# Altium project Sampler.PrjPCB (part 4 of 5)

## Sheet Input_channel.SchDoc: =DocumentName
size A4; DocumentNumber: 1; Revision: 0; SheetNumber: 12; SheetTotal: 15; Version: 2.3.1; Author 1: Grzegorz Kasprowicz; Author 2: Łukasz Pająk; Author 3: Krzysztof Belewicz; Github: https://github.com/sinara-hw/Sampler; Last modified by: Krzysztof Belewicz
Used 8 times, as channels U_Input_channel0, U_Input_channel1, U_Input_channel2, U_Input_channel3, U_Input_channel4, U_Input_channel5, U_Input_channel6, U_Input_channel7. Parts and nets are listed once, with the designators drawn on the sheet.
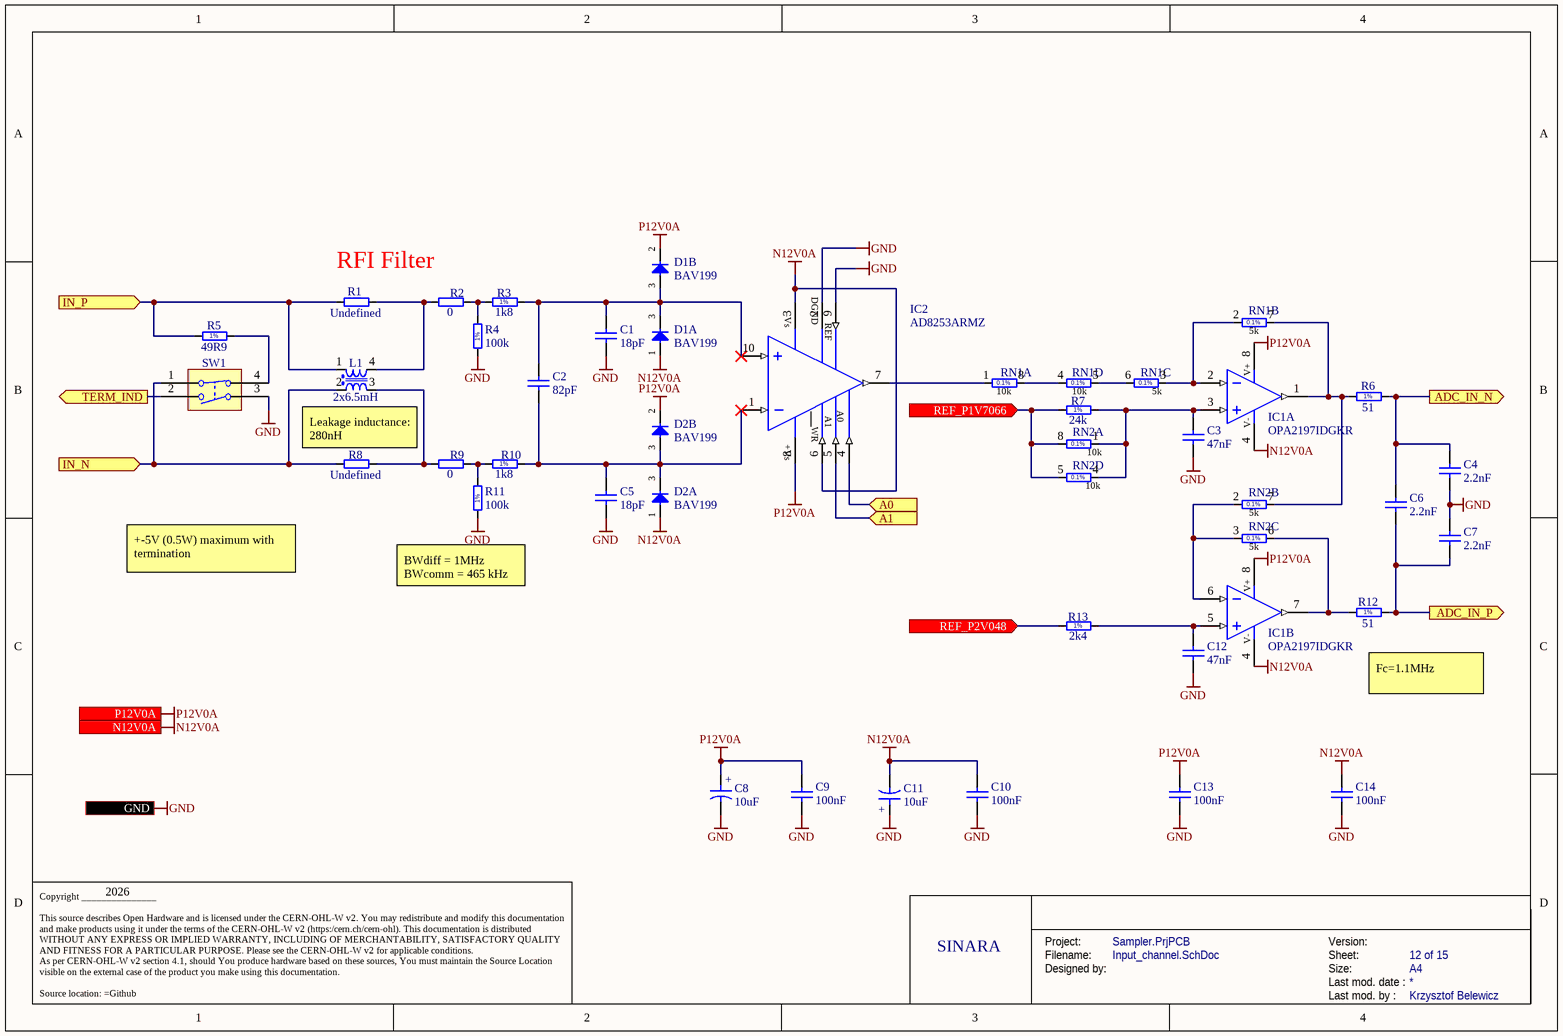
[diagram p11: Input_channel.SchDoc]

### Parts
C1  18pF  [CAPC1608X87N]
C2  82pF  [CAPC2012X90N]
C3  47nF  [CAPC2012X135N]
C4  2.2nF  [CAPC2013X100N]
C5  18pF  [CAPC1608X87N]
C6  2.2nF  [CAPC2013X100N]
C7  2.2nF  [CAPC2013X100N]
C8  10uF  [CAPMP3216X180N]
C9  100nF  [CAPC1005X55N]
C10  100nF  [CAPC1005X55N]
C11  10uF  [CAPMP3216X180N]
C12  47nF  [CAPC2012X135N]
C13  100nF  [CAPC1005X55N]
C14  100nF  [CAPC1005X55N]
D1  BAV199  [SOT95P240X110-3N]  (parts A,B of 2)
D2  BAV199  [SOT95P240X110-3N]  (parts A,B of 2)
IC1  OPA2197IDGKR  [SOP65P490X110-8N]  (parts A,B of 2)
IC2  AD8253ARMZ  [SOP50P490X110-10N]
L1  2x6.5mH  [IND_WURTH_WE-SL2]
R1  Undefined  [RESC1608X55N]
R2  0  [RESC1608X55N]
R3  1k8  [RESC1608X55N]
R4  100k  [RESC1608X55N]
R5  49R9  [RESC6331X70N]
R6  51  [RESC1005X40N]
R7  24k  [RESC1608X55N]
R8  Undefined  [RESC1608X55N]
R9  0  [RESC1608X55N]
R10  1k8  [RESC1608X55N]
R11  100k  [RESC1608X55N]
R12  51  [RESC1005X40N]
R13  2k4  [RESC1005X40N]
RN1  10k 5K 5K 10K  [SOIC127P600X175-8N]  (value not drawn)  (parts A,B,C,D of 4)
RN2  10k 5K 5K 10K  [SOIC127P600X175-8N]  (value not drawn)  (parts A,B,C,D of 4)
SW1  Switch  [SW_CTS_204-121ST]  (value not drawn)

### Ports
A0 (in), A1 (in), ADC_IN_N (out), ADC_IN_P (out), GND, IN_N (in), IN_P (in), N12V0A (in), P12V0A (in), REF_P1V7066 (in), REF_P2V048 (in), TERM_IND (out)

### Nets
GND: C1.1 C3.1 C4.1 C5.1 C7.2 C8.2 C9.1 C10.1 C11.1 C12.1 C13.1 C14.1 IC2.2(DGND) IC2.9(REF) R4.1 R11.1 SW1.3 ; port GND
N12V0A: C10.2 C11.2 C14.2 D1.1(A) D2.1(A) IC1.4(V-) IC2.3(-VS) IC2.6(~{WR}) ; port N12V0A
P12V0A: C8.1 C9.2 C13.2 D1.2(C) D2.2(C) IC1.8(V+) IC2.8(+VS) ; port P12V0A
A0: IC2.4(A0) ; port A0
A1: IC2.5(A1) ; port A1
ADC_IN_N: C4.2 C6.2 R6.2 ; port ADC_IN_N
ADC_IN_P: C6.1 C7.1 R12.2 ; port ADC_IN_P
IN_N: L1.2 R8.1 SW1.1 ; port IN_N
IN_P: L1.1 R1.1 R5.2 ; port IN_P
REF_P1V7066: R7.1 RN2.5 RN2.8 ; port REF_P1V7066
REF_P2V048: R13.1 ; port REF_P2V048
TERM_IND: SW1.2 ; port TERM_IND
NetC1_2: C1.2 C2.2 D1.3(COMAC) IC2.10(+IN) R3.2
NetC2_1: C2.1 C5.2 D2.3(COMAC) IC2.1(-IN) R10.2
NetC3_2: C3.2 IC1.3(IN+) R7.2 RN2.1 RN2.4
NetC12_2: C12.2 IC1.5(IN+) R13.2
NetIC1_1: IC1.1(OUT) R6.1 RN1.7 RN2.7
NetIC1_2: IC1.2(IN-) RN1.2 RN1.3
NetIC1_6: IC1.6(IN-) RN2.2 RN2.3
NetIC1_7: IC1.7(OUT) R12.1 RN2.6
NetIC2_7: IC2.7(OUT) RN1.1
NetL1_3: L1.3 R8.2 R9.1
NetL1_4: L1.4 R1.2 R2.1
NetR2_2: R2.2 R3.1 R4.2
NetR5_1: R5.1 SW1.4
NetR9_2: R9.2 R10.1 R11.2
NetRN1_4: RN1.4 RN1.8
NetRN1_5: RN1.5 RN1.6

### Channels
U_Input_channel0: designators end in H; ports A0=A00 A1=A10 ADC_IN_N=ADC_IN_N0 ADC_IN_P=ADC_IN_P0 GND=GND IN_N=IN_N0 IN_P=IN_P0 N12V0A=N12V0A P12V0A=P12V0A REF_P1V7066=REF_P1V7066 REF_P2V048=REF_P2V048 TERM_IND=TERM_IND0
U_Input_channel1: designators end in A; ports A0=A01 A1=A11 ADC_IN_N=ADC_IN_N1 ADC_IN_P=ADC_IN_P1 GND=GND IN_N=IN_N1 IN_P=IN_P1 N12V0A=N12V0A P12V0A=P12V0A REF_P1V7066=REF_P1V7066 REF_P2V048=REF_P2V048 TERM_IND=TERM_IND1
U_Input_channel2: designators end in B; ports A0=A02 A1=A12 ADC_IN_N=ADC_IN_N2 ADC_IN_P=ADC_IN_P2 GND=GND IN_N=IN_N2 IN_P=IN_P2 N12V0A=N12V0A P12V0A=P12V0A REF_P1V7066=REF_P1V7066 REF_P2V048=REF_P2V048 TERM_IND=TERM_IND2
U_Input_channel3: designators end in C; ports A0=A03 A1=A13 ADC_IN_N=ADC_IN_N3 ADC_IN_P=ADC_IN_P3 GND=GND IN_N=IN_N3 IN_P=IN_P3 N12V0A=N12V0A P12V0A=P12V0A REF_P1V7066=REF_P1V7066 REF_P2V048=REF_P2V048 TERM_IND=TERM_IND3
U_Input_channel4: designators end in D; ports A0=A04 A1=A14 ADC_IN_N=ADC_IN_N4 ADC_IN_P=ADC_IN_P4 GND=GND IN_N=IN_N4 IN_P=IN_P4 N12V0A=N12V0A P12V0A=P12V0A REF_P1V7066=REF_P1V7066 REF_P2V048=REF_P2V048 TERM_IND=TERM_IND4
U_Input_channel5: designators end in E; ports A0=A05 A1=A15 ADC_IN_N=ADC_IN_N5 ADC_IN_P=ADC_IN_P5 GND=GND IN_N=IN_N5 IN_P=IN_P5 N12V0A=N12V0A P12V0A=P12V0A REF_P1V7066=REF_P1V7066 REF_P2V048=REF_P2V048 TERM_IND=TERM_IND5
U_Input_channel6: designators end in F; ports A0=A06 A1=A16 ADC_IN_N=ADC_IN_N6 ADC_IN_P=ADC_IN_P6 GND=GND IN_N=IN_N6 IN_P=IN_P6 N12V0A=N12V0A P12V0A=P12V0A REF_P1V7066=REF_P1V7066 REF_P2V048=REF_P2V048 TERM_IND=TERM_IND6
U_Input_channel7: designators end in G; ports A0=A07 A1=A17 ADC_IN_N=ADC_IN_N7 ADC_IN_P=ADC_IN_P7 GND=GND IN_N=IN_N7 IN_P=IN_P7 N12V0A=N12V0A P12V0A=P12V0A REF_P1V7066=REF_P1V7066 REF_P2V048=REF_P2V048 TERM_IND=TERM_IND7

### Notes on the sheet
- RFI Filter
- Leakage inductance: 280nH
- +-5V (0.5W) maximum with termination
- (near R11) BWdiff = 1MHz
  BWcomm = 465 kHz
- (near R12) Fc=1.1MHz
- 2026
- SINARA
- Project:
- Designed by:
- Filename:
- Size:
- Version:
- Last mod. date :
- Sheet:
- A4
- Copyright _______________
  This source describes Open Hardware and is licensed under the CERN-OHL-W v2. You may redistribute and modify this documentation and make products using it under the terms of the CERN-OHL-W v2 (https:/cern.ch/cern-ohl). This documentation is distributed WITHOUT ANY EXPRESS OR IMPLIED WARRANTY, INCLUDING OF MERCHANTABILITY, SATISFACTORY QUALITY AND FITNESS FOR A PARTICULAR PURPOSE. Please see the CERN-OHL-W v2 for applicable conditions.
  As per CERN-OHL-W v2 section 4.1, should You produce hardware based on these sources, You must maintain the Source Location visible on the external case of the product you make using this documentation.
  Source location: =Github
- Last mod. by :
- (in symbol AD8253ARMZ) -Vs; WR; +Vs
- (in symbol CTE3216-18_10UF_16V_20%_AVX_TCJ) +
- (in symbol R0402_2K4_1%_0.0625W_100PPM) 1%
- (in symbol R0402_51R_1%_0.0625W_100PPM) 1%
- (in symbol R0603_1K8_1%_0.1W_100PPM) 1%
- (in symbol R0603_24K_1%_0.1W_100PPM) 1%
- (in symbol R0603_100K_1%_0.1W_100PPM) 1%
- (in symbol R2512_49R9_1%_1W_100PPM_VISHAY_CRCW) 1%
- (in symbol RN_10K_5K_VISHAY_AORN2-1AT3, part A) 10k
- (in symbol RN_10K_5K_VISHAY_AORN2-1AT3, part B) 5k
- (in symbol RN_10K_5K_VISHAY_AORN2-1AT3, part C) 5k
- (in symbol RN_10K_5K_VISHAY_AORN2-1AT3, part D) 10k

### Library data of the parts
C1 C5 = CC0603_18PF_50V_5%_NP0: Non-polarised capacitor; Part Description: SMD Multilayer Chip Ceramic Capacitor; Manufacturer: GENERIC; Manufacturer1 Part Number: 223886715189; Voltage: 50V; TC: C0G/NP0; Tolerance: ±5%; Part Number: CC0603_18PF_50V_5%_NP0; Component Kind: Standard; Component Type: Standard; Pin Count: 2; Value: 18pF; Status: Preferred; Manufacturer Part Number: CC0603_18PF_50V_5%_NP0; Case: 0603; Mounted: Yes; Socket: No; SMD: Yes; Sense: No; Manufacturer1 Example: PHYCOMP; Manufacturer1 ComponentHeight: 0.87mm; HelpURL: \\cern.ch\dfs\Applications\Altium\Datasheets\CC0603_NP0_PHYCOMP.pdf; Author: CERN DEM JLC; CreateDate: 03.12.2007; LatestRevisionDate: 03.12.2007
C2 = CC0805_82PF_100V_1%_NP0_AVX_08051A820FAT2A: Non-polarised capacitor; Part Description: SMD Multilayer Chip Ceramic Capacitor; Manufacturer: AVX; Voltage: 100V; TC: NP0; Tolerance: ±1%; Part Number: CC0805_82PF_100V_1%_NP0_AVX_08051A820FAT2A; Component Kind: Standard; Component Type: Standard; Pin Count: 2; Value: 82pF; Status: Not Recommended; Manufacturer Part Number: 08051A820FAT2A; Case: 0805; Mounted: Yes; Socket: No; SMD: Yes; Sense: No; ComponentHeight: 0.9mm; HelpURL: \\cern.ch\dfs\Applications\Altium\Datasheets\CC0805_C0G_AVX.pdf; Author: CERN DEM WB; CreateDate: 26.07.2016; LatestRevisionDate: 26.07.2016
C3 C12 = CC0805_47NF_25V_5%_C0G: Non-polarised capacitor; Part Description: SMD Multilayer Chip Ceramic Capacitor; Manufacturer: GENERIC; Manufacturer1 Part Number: C0805C473J3GACTU; Voltage: 25V; TC: C0G/NP0; Tolerance: ±5%; Part Number: CC0805_47NF_25V_5%_C0G; Component Kind: Standard; Component Type: Standard; Pin Count: 2; Value: 47nF; Status: None; Manufacturer Part Number: CC0805_47NF_25V_5%_C0G; Case: 0805; Mounted: Yes; Socket: No; SMD: Yes; Sense: No; Manufacturer1 Example: KEMET; Manufacturer1 ComponentHeight: 1.4mm; HelpURL: \\cern.ch\dfs\Applications\Altium\Datasheets\CC0805_C0G_KEMET_(Commercial Grade).pdf; Author: CERN DEM JLC; CreateDate: 18.01.2011; LatestRevisionDate: 18.01.2011
C4 C6 C7 = CC0805_2.2NF_25V_1%_C0G: Non-polarised capacitor; Part Description: SMD Multilayer Chip Ceramic Capacitor; Manufacturer: GENERIC; Manufacturer1 Part Number: C0805C222F3GACTU; Voltage: 25V; TC: C0G/NP0; Tolerance: ±1%; Part Number: CC0805_2.2NF_25V_1%_C0G; Component Kind: Standard; Component Type: Standard; Pin Count: 2; Value: 2.2nF; Status: None; Manufacturer Part Number: CC0805_2.2NF_25V_1%_C0G; Case: 0805; Mounted: Yes; Socket: No; SMD: Yes; Sense: No; Manufacturer1 Example: KEMET; Manufacturer1 ComponentHeight: 0.88mm; HelpURL: \\cern.ch\dfs\Applications\Altium\Datasheets\CC0805_C0G_KEMET_(Commercial Grade).pdf; Author: CERN DEM JLC; CreateDate: 11.03.2015; LatestRevisionDate: 11.03.2015
C8 C11 = CTE3216-18_10UF_16V_20%_AVX_TCJ: Polarised capacitor; Part Description: ESR 0R200 Tantalum Solid Electrolytic Chip Capacitor with Conductive Polymer Electrode; Manufacturer: AVX; Manufacturer Part Number: TCJA106M016R0200; Voltage: 16V; Tolerance: ±20%; Part Number: CTE3216-18_10UF_16V_20%_AVX_TCJ; Component Kind: Standard; Component Type: Standard; Pin Count: 2; Value: 10uF; Status: Preferred; Case: A; Mounted: Yes; Socket: No; SMD: Yes; Sense: No; ComponentHeight: 1.8mm; HelpURL: \\cern.ch\dfs\Applications\Altium\Datasheets\CTE_AVX_TCJ.pdf; Author: CERN DEM JLC; CreateDate: 29.03.2012; LatestRevisionDate: 29.03.2012
C9 C10 C13 C14 = CC0402_100NF_50V_10%_X7R: as T_C3-T_C6 on sheet EEM_Connectors; Part Number: CC0402_100NF_50V_10%_X7R; Component Kind: Standard; Component Type: Standard; Pin Count: 2; Value: 100nF; Status: None; Manufacturer Part Number: CC0402_100NF_50V_10%_X7R; Case: 0402; Mounted: Yes; Socket: No; SMD: Yes; Sense: No; Manufacturer1 Example: MURATA; Manufacturer1 ComponentHeight: 0.55mm; HelpURL: \\cern.ch\dfs\Applications\Altium\Datasheets\CC0402_MURATA_GRM155R71H104KE14D.pdf; Author: CERN DEM MR; CreateDate: 30.06.2017; LatestRevisionDate: 30.06.2017
D1 D2 = BAV199: Serial Diode; Part Description: Low-Leakage Double Diode; Manufacturer: NXP SEMICONDUCTORS; Voltage: 75V; Power: 250mW; PressFit: No; Bonding: No; Part Number: BAV199; Component Kind: Standard; Component Type: Standard; Device: BAV199; PackageDescription: SOT23 3-Leads, Pitch 0.95mm - Body 1.4x3mm, IPC Medium Density; Manufacturer Part Number: BAV199; Pin Count: 3; Case: SOT23-3; Mounted: Yes; Socket: No; SMD: Yes; Sense: No; ComponentHeight: 1.1mm; HelpURL: \\cern.ch\dfs\Applications\Altium\Datasheets\BAV199.pdf; Author: CERN DEM JMW; CreateDate: 2008-11-21; LatestRevisionDate: 2008-11-21
IC1 = OA_OPA2197IDGKR: 36-V, Precision, Rail-to-Rail Input Output, Low Offset Voltage Op Amp 8-VSSOP; Part Description: High-Precision, Low-Noise, Rail-to-Rail Output,10-MHz Op Amp; Manufacturer: TEXAS INSTRUMENTS; PressFit: No; Bonding: No; Part Number: OPA2197IDGKR; Component Kind: Standard; Component Type: Standard; Device: OPA2197IDGKR; PackageDescription: SOP, 0.65mm pitch; 8 pin, 3.00mm W X 3.00mm L X 1.10mm H body, IPC Medium Density; Manufacturer Part Number: OPA2197IDGKR; Pin Count: 8; Case: MSOP8; Mounted: Yes; Socket: No; SMD: Yes; Sense: No; ComponentHeight: 1.1mm; Author: GK; HelpURL: \\cern.ch\dfs\Applications\Altium\Datasheets\OPA2140AIDGK.pdf; CreateDate: 20.04.2017; LatestRevisionDate: 20.04.2017
IC2 = AD8253ARMZ: 10MHz, 20V/us, G= 1, 10, 100, 1000 iCMOS Programmable Gain Instrumentation Amplifier; Manufacturer: ANALOG DEVICES; PressFit: No; Bonding: No; Part Number: AD8253ARMZ; Component Kind: Standard; Component Type: Standard; Device: AD8253ARMZ; PackageDescription: MSOP, 10-Leads, Body 3.1x3.1mm (max), Pitch 0.50mm, IPC Medium Density; Part Description: 10MHz, 20V/us, G= 1, 10, 100, 1000 iCMOS Programmable Gain Instrumentation Amplifier; Manufacturer Part Number: AD8253ARMZ; Pin Count: 8; Case: MSOP10; Mounted: Yes; Socket: No; SMD: Yes; Sense: No; ComponentHeight: 1.1mm; Author: CERN DEM JLC; HelpURL: \\cern.ch\dfs\Applications\Altium\Datasheets\AD8253ARMZ.pdf; CreateDate: 2013-10-02; LatestRevisionDate: 2013-10-02
L1 = IND_6.5MH_50%_WURTH_WE-SL2-744229: Inductor Common Mode; Part Description: Common Mode SMD Line Filter (WE-SL2 Serie); Manufacturer: WURTH ELEKTRONIK; Manufacturer Part Number: 744229; Power: 400mA; Resistance: 0.95R; Tolerance: ±50%; Part Number: IND_6.5MH_50%_WURTH_WE-SL2-744229; Component Kind: Standard; Component Type: Standard; Pin Count: 4; Value: 2x6.5mH; Status: None; Mounted: Yes; Socket: No; SMD: Yes; Sense: No; ComponentHeight: 5.3mm; HelpURL: \\cern.ch\dfs\Applications\Altium\Datasheets\IND_WURTH_WE-SL2_744229.pdf; Author: CERN DEM JLC; CreateDate: 01.10.2012; LatestRevisionDate: 15.10.2012
R1 R8 = R0603_NO-VALUE: Resistor; Part Description: Reserved Footprint For a 0603 (1608) Chip Resistor; Mounted: No; Part Number: R0603_NO-VALUE; Component Kind: Standard; Component Type: Standard; Pin Count: 2; Value: Undefined; Status: None; Manufacturer: Undefined; Manufacturer Part Number: R0603_NO-VALUE; Case: 0603; Sense: No; Socket: No; SMD: Yes; Manufacturer1 Example: Undefined; Manufacturer1 Part Number: Undefined; Manufacturer1 ComponentHeight: Undefined; HelpURL: Undefined; Author: CERN DEM JLC; CreateDate: 03.12.2007; LatestRevisionDate: 13.03.2008
R2 R9 = R0603_0R_JUMPER: Resistor; Part Description: 1A (0.05R Max DC Resistance) Zero Ohm Jumper; Manufacturer: GENERIC; Manufacturer1 Part Number: NRC06Z0; Part Number: R0603_0R_JUMPER; Component Kind: Standard; Component Type: Standard; Pin Count: 2; Value: 0; Status: Preferred; Manufacturer Part Number: R0603_0R_JUMPER; Case: 0603; Mounted: Yes; Sense: No; Socket: No; SMD: Yes; Manufacturer1 Example: NIC COMPONENT; Manufacturer1 ComponentHeight: 0.55mm; HelpURL: \\cern.ch\dfs\Applications\Altium\Datasheets\R0603_NIC_NRC.pdf; Author: CERN DEM JLC; CreateDate: 03.12.2007; LatestRevisionDate: 13.03.2008
R3 R10 = R0603_1K8_1%_0.1W_100PPM: Resistor - 1%; Part Description: General Purpose Thick Film Chip Resistor; Manufacturer: GENERIC; Manufacturer1 Part Number: NRC06F1801TRF; Power: 0.1W; TC: ±100ppm/°C; Part Number: R0603_1K8_1%_0.1W_100PPM; Component Kind: Standard; Component Type: Standard; Pin Count: 2; Value: 1k8; Status: Preferred; Tolerance: ±1%; Manufacturer Part Number: R0603_1K8_1%_0.1W_100PPM; Case: 0603; Mounted: Yes; Sense: No; Socket: No; SMD: Yes; Manufacturer1 Example: NIC COMPONENT; Manufacturer1 ComponentHeight: 0.55mm; HelpURL: \\cern.ch\dfs\Applications\Altium\Datasheets\R0603_NIC_NRC.pdf; Author: CERN DEM JLC; CreateDate: 03.12.2007; LatestRevisionDate: 13.03.2008
R4 R11 = R0603_100K_1%_0.1W_100PPM: Resistor - 1%; Part Description: General Purpose Thick Film Chip Resistor; Manufacturer: GENERIC; Manufacturer1 Part Number: NRC06F1003TRF; Power: 0.1W; TC: ±100ppm/°C; Part Number: R0603_100K_1%_0.1W_100PPM; Component Kind: Standard; Component Type: Standard; Pin Count: 2; Value: 100k; Status: Preferred; Tolerance: ±1%; Manufacturer Part Number: R0603_100K_1%_0.1W_100PPM; Case: 0603; Mounted: Yes; Sense: No; Socket: No; SMD: Yes; Manufacturer1 Example: NIC COMPONENT; Manufacturer1 ComponentHeight: 0.55mm; HelpURL: \\cern.ch\dfs\Applications\Altium\Datasheets\R0603_NIC_NRC.pdf; Author: CERN DEM JLC; CreateDate: 03.12.2007; LatestRevisionDate: 13.03.2008
R5 = R2512_49R9_1%_1W_100PPM_VISHAY_CRCW: Resistor - 1%; Part Description: Thick Film Chip Resistor; Manufacturer: VISHAY DRALORIC; Manufacturer Part Number: CRCW251249R9FKEG; Power: 1W; TC: ±100ppm/°C; PressFit: No; Part Number: R2512_49R9_1%_1W_100PPM_VISHAY_CRCW; Component Kind: Standard; Component Type: Standard; Pin Count: 2; Value: 49R9; Status: None; Tolerance: ±1%; Case: 2512; Mounted: Yes; Sense: No; Socket: No; SMD: Yes; ComponentHeight: 0.7mm; HelpURL: \\cern.ch\dfs\Applications\Altium\Datasheets\R2512_VISHAY_CRCW2512.pdf; Author: CERN DEM JLC; CreateDate: 22.05.2012; LatestRevisionDate: 22.05.2012
R6 R12 = R0402_51R_1%_0.0625W_100PPM: Resistor - 1%; Part Description: General Purpose Thick Film Chip Resistor; Manufacturer: GENERIC; Manufacturer1 Part Number: 232270675109L; TC: ±100ppm/°C; PressFit: No; Part Number: R0402_51R_1%_0.0625W_100PPM; Component Kind: Standard; Component Type: Standard; Pin Count: 2; Value: 51; Status: Not Recommended; Power: 0.0625W; Tolerance: ±1%; Manufacturer Part Number: R0402_51R_1%_0.0625W_100PPM; Case: 0402; Mounted: Yes; Sense: No; Socket: No; SMD: Yes; Manufacturer1 Example: YAGEO PHYCOMP; Manufacturer1 ComponentHeight: 0.4mm; HelpURL: \\cern.ch\dfs\Applications\Altium\Datasheets\R0402_Phycomp_RC0402.pdf; Author: CERN DEM JLC; CreateDate: 03.12.2007; LatestRevisionDate: 17.10.2012
R7 = R0603_24K_1%_0.1W_100PPM: Resistor - 1%; Part Description: General Purpose Thick Film Chip Resistor; Manufacturer: GENERIC; Manufacturer1 Part Number: NRC06F2402TRF; Power: 0.1W; TC: ±100ppm/°C; PressFit: No; Part Number: R0603_24K_1%_0.1W_100PPM; Component Kind: Standard; Component Type: Standard; Pin Count: 2; Value: 24k; Status: Preferred; Tolerance: ±1%; Manufacturer Part Number: R0603_24K_1%_0.1W_100PPM; Case: 0603; Mounted: Yes; Sense: No; Socket: No; SMD: Yes; Manufacturer1 Example: NIC COMPONENT; Manufacturer1 ComponentHeight: 0.55mm; HelpURL: \\cern.ch\dfs\Applications\Altium\Datasheets\R0603_NIC_NRC.pdf; Author: CERN DEM JLC; CreateDate: 03.12.2007; LatestRevisionDate: 13.03.2008
R13 = R0402_2K4_1%_0.0625W_100PPM: Resistor - 1%; Part Description: General Purpose Thick Film Chip Resistor; Manufacturer: GENERIC; Manufacturer1 Part Number: 232270672402L; TC: ±100ppm/°C; PressFit: No; Part Number: R0402_2K4_1%_0.0625W_100PPM; Component Kind: Standard; Component Type: Standard; Pin Count: 2; Value: 2k4; Status: Not Recommended; Power: 0.0625W; Tolerance: ±1%; Manufacturer Part Number: R0402_2K4_1%_0.0625W_100PPM; Case: 0402; Mounted: Yes; Sense: No; Socket: No; SMD: Yes; Manufacturer1 Example: YAGEO PHYCOMP; Manufacturer1 ComponentHeight: 0.4mm; HelpURL: \\cern.ch\dfs\Applications\Altium\Datasheets\R0402_Phycomp_RC0402.pdf; Author: CERN DEM JLC; CreateDate: 03.12.2007; LatestRevisionDate: 17.10.2012
RN1 RN2 = RN_10K_5K_VISHAY_AORN2-1AT3: DIL8 Resistor Network 4 Resistors 10k-5k-5k-10k 0.1%; Part Description: Dual-In-Line Thin Film Precision Automotive Resistors Network, (4 Isolated) - AORN Series; Manufacturer: VISHAY DALE; Power: 4x0.1W; TC: ±25ppm/°C; PressFit: No; Part Number: RN_10K_5K_VISHAY_AORN2-1AT3; Component Kind: Standard; Component Type: Standard; Pin Count: 8; Value: 10k 5K 5K 10K; Sense: No; Tolerance: 0.1%; Manufacturer Part Number: AORN2-1AT3; Case: SOIC8; Mounted: Yes; Socket: No; SMD: Yes; ComponentHeight: 1.73mm; HelpURL: \\cern.ch\dfs\Applications\Altium\Datasheets\RN_VISHAY_AORN.pdf; Author: CERN DEM JLC; CreateDate: 20.02.2017; LatestRevisionDate: 20.02.2017
SW1 = SW_CTS_204-121ST: 2x SPST DIP Switch 1NO + 1NF; Part Description: Coupled SPST DIP Switch, 1NO + 1NF, CTS 204 Series; Manufacturer: CTS; PressFit: No; Part Number: SW_CTS_204-121ST; Component Kind: Standard; Component Type: Standard; Pin Count: 4; PackageDescription: Body 7.26 x 9.78mm, 2x SPST DIP, 1NO + 1NF Switch, CTS 204 Series; Family: Switch; Mounted: Yes; Socket: No; SMD: Yes; Sense: No; Status: None; Manufacturer Part Number: 204-121ST; ComponentHeight: 10.36mm; HelpURL: \\cern.ch\dfs\Applications\Altium\Datasheets\SW_CTS_204-121ST.pdf; Author: CERN DEM JLC; CreateDate: 28.08.2014; LatestRevisionDate: 28.08.2014

## Sheet Drivers.SchDoc: =DocumentName
size A3; DocumentNumber: 1; Revision: 0; SheetNumber: 14; SheetTotal: 15; Version: 2.3.1; Author 1: Grzegorz Kasprowicz; Author 2: Łukasz Pająk; Author 3: Krzysztof Belewicz; Github: https://github.com/sinara-hw/Sampler; Last modified by: Krzysztof Belewicz
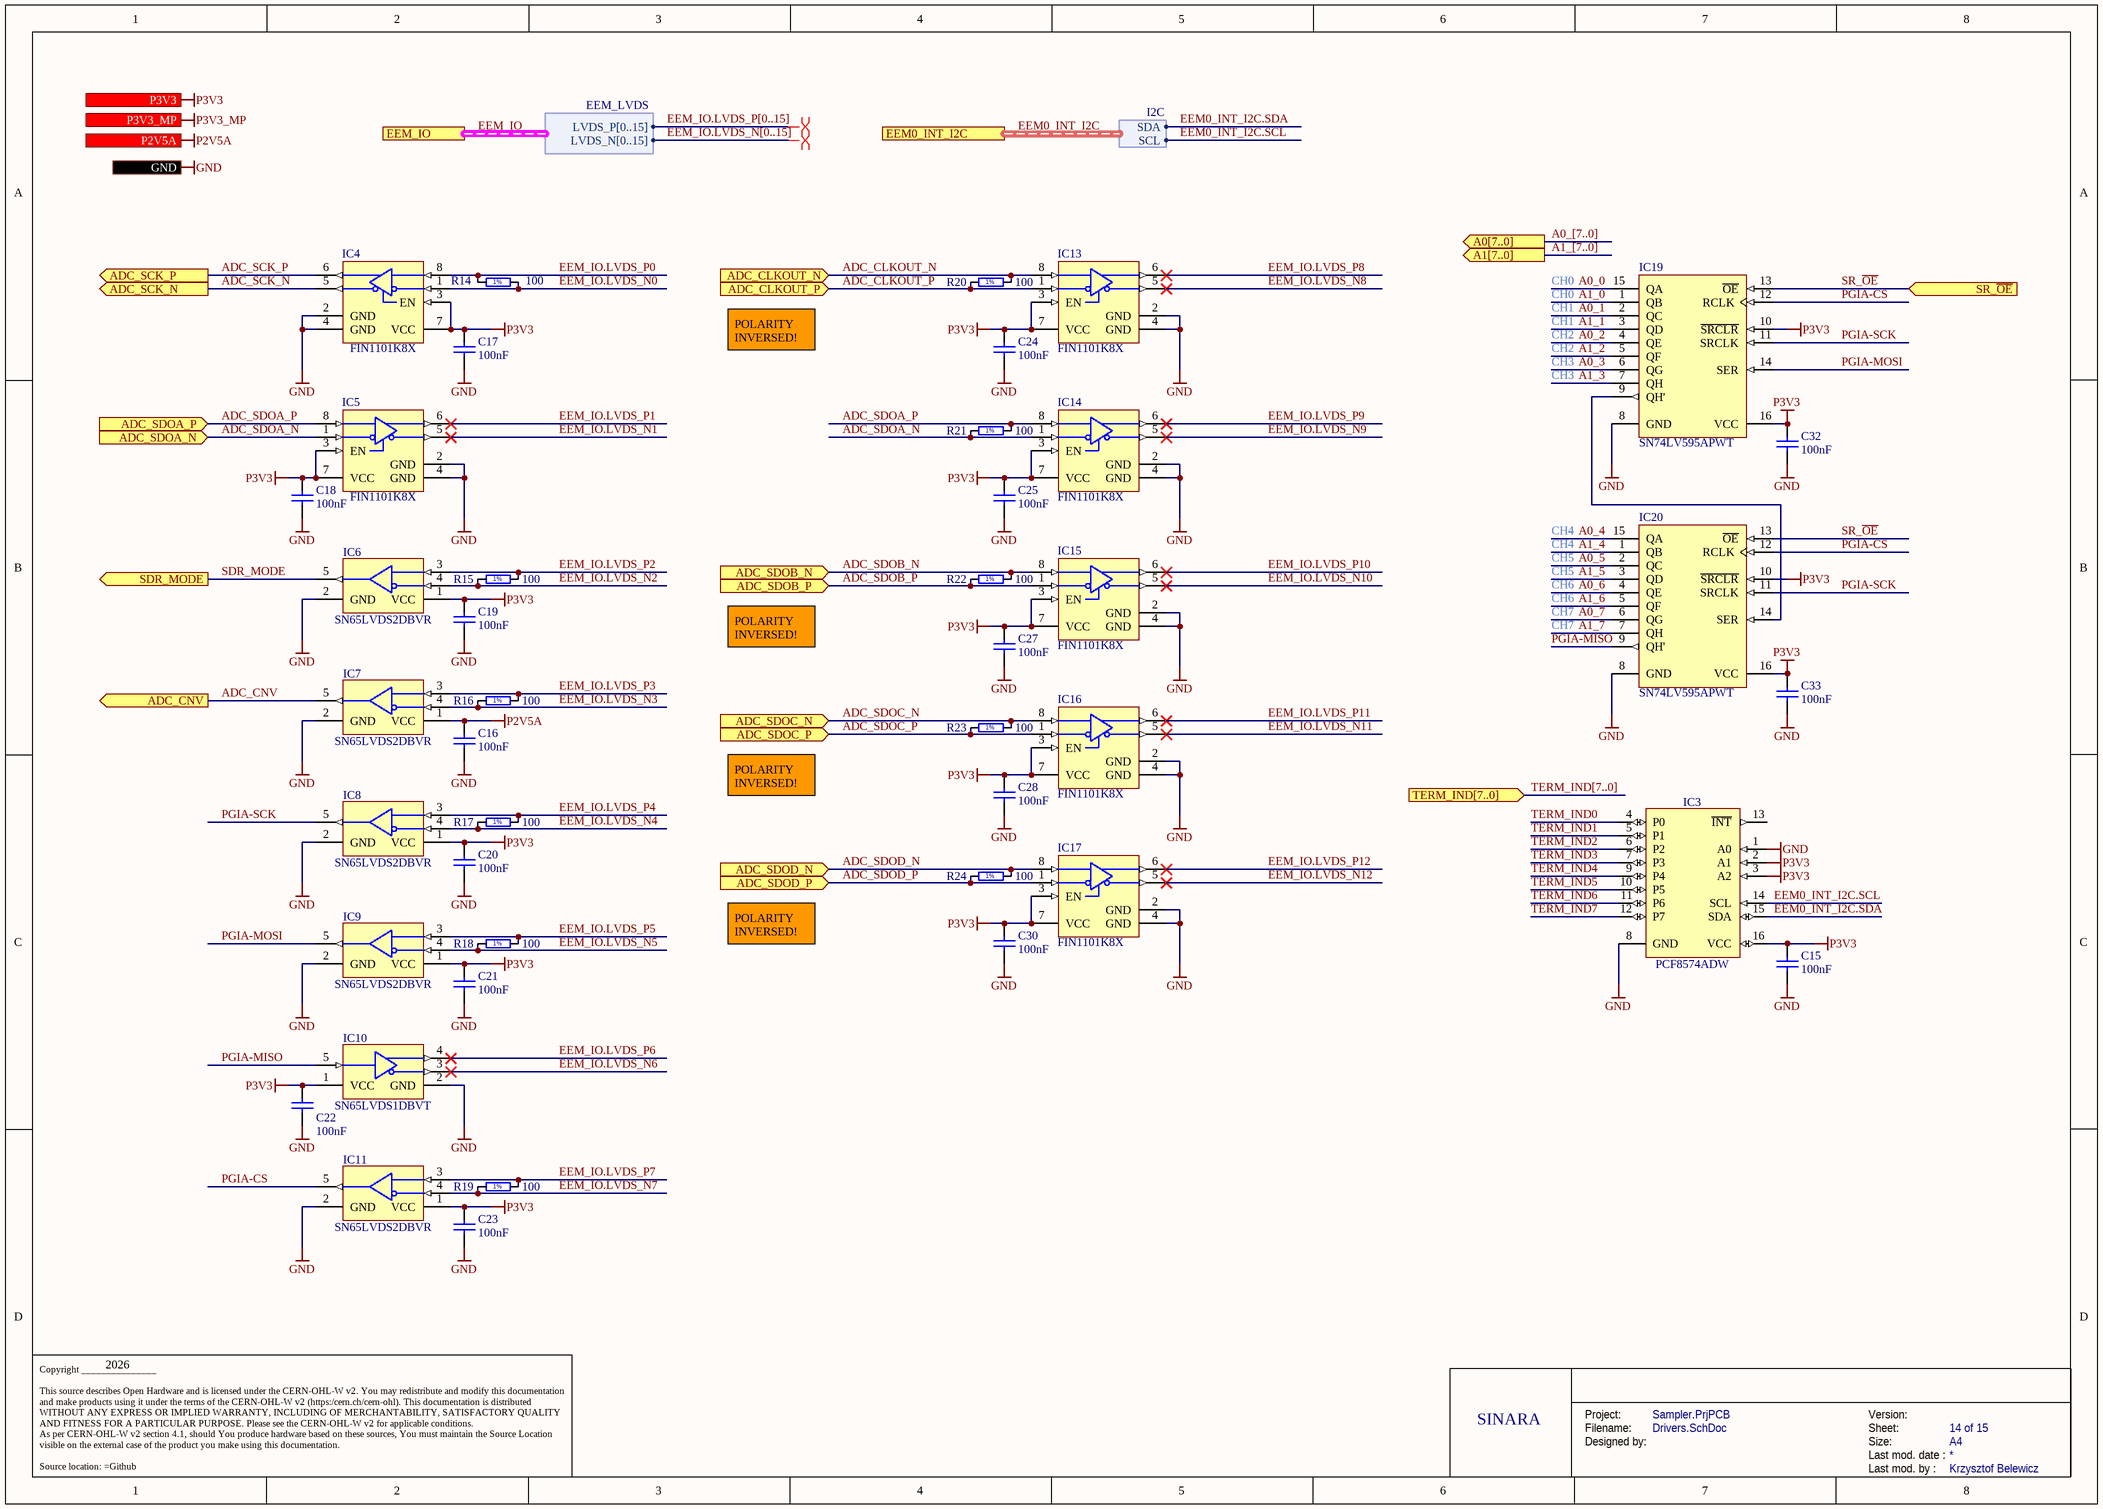
[diagram p12: Drivers.SchDoc]

### Parts
C15  100nF  [CAPC1005X55N]
C16  100nF  [CAPC1005X55N]
C17  100nF  [CAPC1005X55N]
C18  100nF  [CAPC1005X55N]
C19  100nF  [CAPC1005X55N]
C20  100nF  [CAPC1005X55N]
C21  100nF  [CAPC1005X55N]
C22  100nF  [CAPC1005X55N]
C23  100nF  [CAPC1005X55N]
C24  100nF  [CAPC1005X55N]
C25  100nF  [CAPC1005X55N]
C27  100nF  [CAPC1005X55N]
C28  100nF  [CAPC1005X55N]
C30  100nF  [CAPC1005X55N]
C32  100nF  [CAPC1005X55N]
C33  100nF  [CAPC1005X55N]
IC3  PCF8574ADW  [SOIC127P1030X265-16N]
IC4  FIN1101K8X  [SOP50P310X90-8N]
IC5  FIN1101K8X  [SOP50P310X90-8N]
IC6  SN65LVDS2DBVR  [SOT95P280X145-5N]
IC7  SN65LVDS2DBVR  [SOT95P280X145-5N]
IC8  SN65LVDS2DBVR  [SOT95P280X145-5N]
IC9  SN65LVDS2DBVR  [SOT95P280X145-5N]
IC10  SN65LVDS1DBVT  [SOT95P280X145-5N]
IC11  SN65LVDS2DBVR  [SOT95P280X145-5N]
IC13  FIN1101K8X  [SOP50P310X90-8N]
IC14  FIN1101K8X  [SOP50P310X90-8N]
IC15  FIN1101K8X  [SOP50P310X90-8N]
IC16  FIN1101K8X  [SOP50P310X90-8N]
IC17  FIN1101K8X  [SOP50P310X90-8N]
IC19  SN74LV595APWT  [SOP65P640X120-16N]
IC20  SN74LV595APWT  [SOP65P640X120-16N]
R14  100  [RESC1005X40N]
R15  100  [RESC1005X40N]
R16  100  [RESC1005X40N]
R17  100  [RESC1005X40N]
R18  100  [RESC1005X40N]
R19  100  [RESC1005X40N]
R20  100  [RESC1005X40N]
R21  100  [RESC1005X40N]
R22  100  [RESC1005X40N]
R23  100  [RESC1005X40N]
R24  100  [RESC1005X40N]

### Ports
A0[7..0] (out), A1[7..0] (out), ADC_CLKOUT_N (in), ADC_CLKOUT_P (in), ADC_CNV (out), ADC_SCK_N (out), ADC_SCK_P (out), ADC_SDOA_N (in), ADC_SDOA_P (in), ADC_SDOB_N (in), ADC_SDOB_P (in), ADC_SDOC_N (in), ADC_SDOC_P (in), ADC_SDOD_N (in), ADC_SDOD_P (in), EEM0_INT_I2C (harness I2C), EEM_IO (harness EEM_LVDS), GND, P2V5A (in), P3V3 (in), P3V3_MP (in), SDR_MODE (out), SR_~{OE} (in), TERM_IND[7..0] (in)

### Harnesses
EEM_LVDS: LVDS_P[0..15], LVDS_N[0..15]
I2C: SDA, SCL

### Nets
GND: C15.1 C16.1 C17.1 C18.1 C19.1 C20.1 C21.1 C22.1 C23.1 C24.1 C25.1 C27.1 C28.1 C30.1 C32.1 C33.1 IC3.1(A0) IC3.8(GND) IC4.2(GND) IC4.4(GND) IC5.2(GND) IC5.4(GND) IC6.2(GND) IC7.2(GND) IC8.2(GND) IC9.2(GND) IC10.2(GND) IC11.2(GND) IC13.2(GND) IC13.4(GND) IC14.2(GND) IC14.4(GND) IC15.2(GND) IC15.4(GND) IC16.2(GND) IC16.4(GND) IC17.2(GND) IC17.4(GND) IC19.8(GND) IC20.8(GND) ; port GND
P2V5A: C16.2 IC7.1(VCC) ; port P2V5A
P3V3: C15.2 C17.2 C18.2 C19.2 C20.2 C21.2 C22.2 C23.2 C24.2 C25.2 C27.2 C28.2 C30.2 C32.2 C33.2 IC3.2(A1) IC3.3(A2) IC3.16(VCC) IC4.3(EN) IC4.7(VCC) IC5.3(EN) IC5.7(VCC) IC6.1(VCC) IC8.1(VCC) IC9.1(VCC) IC10.1(VCC) IC11.1(VCC) IC13.3(EN) IC13.7(VCC) IC14.3(EN) IC14.7(VCC) IC15.3(EN) IC15.7(VCC) IC16.3(EN) IC16.7(VCC) IC17.3(EN) IC17.7(VCC) IC19.10(~{SRCLR}) IC19.16(VCC) IC20.10(~{SRCLR}) IC20.16(VCC) ; port P3V3
A0_0: IC19.15(QA)  [project net A00]
A0_1: IC19.2(QC)  [project net A01]
A0_2: IC19.4(QE)  [project net A02]
A0_3: IC19.6(QG)  [project net A03]
A0_4: IC20.15(QA)  [project net A04]
A0_5: IC20.2(QC)  [project net A05]
A0_6: IC20.4(QE)  [project net A06]
A0_7: IC20.6(QG)  [project net A07]
A1_0: IC19.1(QB)  [project net A10]
A1_1: IC19.3(QD)  [project net A11]
A1_2: IC19.5(QF)  [project net A12]
A1_3: IC19.7(QH)  [project net A13]
A1_4: IC20.1(QB)  [project net A14]
A1_5: IC20.3(QD)  [project net A15]
A1_6: IC20.5(QF)  [project net A16]
A1_7: IC20.7(QH)  [project net A17]
ADC_CLKOUT_N: IC13.8(RIN+) R20.2 ; port ADC_CLKOUT_N
ADC_CLKOUT_P: IC13.1(RIN-) R20.1 ; port ADC_CLKOUT_P
ADC_CNV: IC7.5(R) ; port ADC_CNV
ADC_SCK_N: IC4.5(DOUT-) ; port ADC_SCK_N
ADC_SCK_P: IC4.6(DOUT+) ; port ADC_SCK_P
ADC_SDOA_N: IC5.1(RIN-) IC14.1(RIN-) R21.1 ; port ADC_SDOA_N
ADC_SDOA_P: IC5.8(RIN+) IC14.8(RIN+) R21.2 ; port ADC_SDOA_P
ADC_SDOB_N: IC15.8(RIN+) R22.2 ; port ADC_SDOB_N
ADC_SDOB_P: IC15.1(RIN-) R22.1 ; port ADC_SDOB_P
ADC_SDOC_N: IC16.8(RIN+) R23.2 ; port ADC_SDOC_N
ADC_SDOC_P: IC16.1(RIN-) R23.1 ; port ADC_SDOC_P
ADC_SDOD_N: IC17.8(RIN+) R24.2 ; port ADC_SDOD_N
ADC_SDOD_P: IC17.1(RIN-) R24.1 ; port ADC_SDOD_P
EEM0_INT_I2C.SCL: IC3.14(SCL) ; port EEM0_INT_I2C.SCL
EEM0_INT_I2C.SDA: IC3.15(SDA) ; port EEM0_INT_I2C.SDA
EEM_IO.LVDS_N0: IC4.1(RIN-) R14.1
EEM_IO.LVDS_N1: IC5.5(DOUT-)
EEM_IO.LVDS_N2: IC6.4(B) R15.1
EEM_IO.LVDS_N3: IC7.4(B) R16.1
EEM_IO.LVDS_N4: IC8.4(B) R17.1
EEM_IO.LVDS_N5: IC9.4(B) R18.1
EEM_IO.LVDS_N6: IC10.3(A)
EEM_IO.LVDS_N7: IC11.4(B) R19.1
EEM_IO.LVDS_N8: IC13.5(DOUT-)
EEM_IO.LVDS_N9: IC14.5(DOUT-)
EEM_IO.LVDS_N10: IC15.5(DOUT-)
EEM_IO.LVDS_N11: IC16.5(DOUT-)
EEM_IO.LVDS_N12: IC17.5(DOUT-)
EEM_IO.LVDS_P0: IC4.8(RIN+) R14.2
EEM_IO.LVDS_P1: IC5.6(DOUT+)
EEM_IO.LVDS_P2: IC6.3(A) R15.2
EEM_IO.LVDS_P3: IC7.3(A) R16.2
EEM_IO.LVDS_P4: IC8.3(A) R17.2
EEM_IO.LVDS_P5: IC9.3(A) R18.2
EEM_IO.LVDS_P6: IC10.4(B)
EEM_IO.LVDS_P7: IC11.3(A) R19.2
EEM_IO.LVDS_P8: IC13.6(DOUT+)
EEM_IO.LVDS_P9: IC14.6(DOUT+)
EEM_IO.LVDS_P10: IC15.6(DOUT+)
EEM_IO.LVDS_P11: IC16.6(DOUT+)
EEM_IO.LVDS_P12: IC17.6(DOUT+)
PGIA-CS: IC11.5(R) IC19.12(RCLK) IC20.12(RCLK)
PGIA-MISO: IC10.5(R) IC20.9(QH')
PGIA-MOSI: IC9.5(R) IC19.14(SER)
PGIA-SCK: IC8.5(R) IC19.11(SRCLK) IC20.11(SRCLK)
SDR_MODE: IC6.5(R) ; port SDR_MODE
SR_~{OE}: IC19.13(~{OE}) IC20.13(~{OE}) ; port SR_~{OE}
TERM_IND0: IC3.4(P0)
TERM_IND1: IC3.5(P1)
TERM_IND2: IC3.6(P2)
TERM_IND3: IC3.7(P3)
TERM_IND4: IC3.9(P4)
TERM_IND5: IC3.10(P5)
TERM_IND6: IC3.11(P6)
TERM_IND7: IC3.12(P7)
NetIC19_9: IC19.9(QH') IC20.14(SER)

Not connected (* = marked no-connect by the designer): IC3 13(~{INT})

### Buses and harness runs
bus A0_[7..0] = port A0[7..0]
bus A1_[7..0] = port A1[7..0]
bus EEM_IO.LVDS_N[0..15]
bus EEM_IO.LVDS_P[0..15]
bus TERM_IND[7..0] = port TERM_IND[7..0]
harness EEM0_INT_I2C = port EEM0_INT_I2C
harness EEM_IO = port EEM_IO

### Layout directives
differential pair; differential pair class Diff_100Ohm: (no net found under the mark)

### Notes on the sheet
- CH0
- CH1
- POLARITY INVERSED!
- CH2
- CH3
- CH4
- CH5
- CH6
- CH7
- 2026
- SINARA
- Project:
- Designed by:
- Filename:
- Size:
- Version:
- Last mod. date :
- Sheet:
- A4
- Copyright _______________
  This source describes Open Hardware and is licensed under the CERN-OHL-W v2. You may redistribute and modify this documentation and make products using it under the terms of the CERN-OHL-W v2 (https:/cern.ch/cern-ohl). This documentation is distributed WITHOUT ANY EXPRESS OR IMPLIED WARRANTY, INCLUDING OF MERCHANTABILITY, SATISFACTORY QUALITY AND FITNESS FOR A PARTICULAR PURPOSE. Please see the CERN-OHL-W v2 for applicable conditions.
  As per CERN-OHL-W v2 section 4.1, should You produce hardware based on these sources, You must maintain the Source Location visible on the external case of the product you make using this documentation.
  Source location: =Github
- Last mod. by :
- (in symbol R0402_100R_1%_0.1W_100PPM) 1%

### Library data of the parts
C15-C25 C27 C28 C30 C32 C33 = CC0402_100NF_50V_10%_X7R: as T_C3-T_C6 on sheet EEM_Connectors; Part Number: CC0402_100NF_50V_10%_X7R; Component Kind: Standard; Component Type: Standard; Pin Count: 2; Value: 100nF; Status: None; Manufacturer Part Number: CC0402_100NF_50V_10%_X7R; Case: 0402; Mounted: Yes; Socket: No; SMD: Yes; Sense: No; Manufacturer1 Example: MURATA; Manufacturer1 ComponentHeight: 0.55mm; HelpURL: \\cern.ch\dfs\Applications\Altium\Datasheets\CC0402_MURATA_GRM155R71H104KE14D.pdf; Author: CERN DEM MR; CreateDate: 30.06.2017; LatestRevisionDate: 30.06.2017
IC3 = PCF8574ADW: Remote 8-bit I/O Expander For I2C Bus; Manufacturer: TEXAS INSTRUMENTS; PressFit: No; Bonding: No; Part Number: PCF8574ADW; Component Kind: Standard; Component Type: Standard; Device: PCF8574ADW; PackageDescription: SOIC 16, Pitch 1.27mm - Body 7.5x10.3mm, IPC Medium Density; Part Description: Remote 8-bit I/O Expander For I2C Bus; Manufacturer Part Number: PCF8574ADW; Pin Count: 16; Case: SOIC16W; Mounted: Yes; Socket: No; SMD: Yes; Sense: No; ComponentHeight: 2.65mm; Author: CERN DEM JLC; HelpURL: \\cern.ch\dfs\Applications\Altium\Datasheets\PCF8574ADW.pdf; CreateDate: 01.11.2012; LatestRevisionDate: 01.11.2012
IC4 IC5 IC13-IC17 = FIN1101K8X: LVDS Single Port High Speed Repeater; Manufacturer: FAIRCHILD SEMICONDUCTOR; PressFit: No; Bonding: No; Part Number: FIN1101K8X; Component Kind: Standard; Component Type: Standard; Device: FIN1101K8X; PackageDescription: SOP, 0.50mm Pitch; 8 pin, 2.30mm W X 2.00mm L X 0.90mm H body, PC Medium Density; Part Description: LVDS Single Port High Speed Repeater; Manufacturer Part Number: FIN1101K8X; Pin Count: 8; Case: TSSOP8; Mounted: Yes; Socket: No; SMD: Yes; Sense: No; ComponentHeight: 0.8mm; Author: CERN DEM JLC; HelpURL: \\cern.ch\dfs\Applications\Altium\Datasheets\FIN1101K8X.pdf; CreateDate: 08.11.2016; LatestRevisionDate: 08.11.2016
IC6-IC9 IC11 = SN65LVDS2DBVR: High-Speed Differential Line Receiver; Manufacturer: TEXAS INSTRUMENTS; PressFit: No; Bonding: No; Part Number: SN65LVDS2DBVR; Component Kind: Standard; Component Type: Standard; Device: SN65LVDS2DBVR; PackageDescription: SOT, 0.95mm pitch; 5 pin, 1.60mm W X 2.90mm L X 1.45mm H body, IPC Medium Density; Part Description: High-Speed Differential Line Receiver; Manufacturer Part Number: SN65LVDS2DBVR; Pin Count: 5; Case: SOT23-5; Mounted: Yes; Socket: No; SMD: Yes; Sense: No; ComponentHeight: 1.45mm; Author: CERN DEM JLC; HelpURL: \\cern.ch\dfs\Applications\Altium\Datasheets\SN65LVDS2DBVR.pdf; CreateDate: 03.03.2011; LatestRevisionDate: 22.09.2011
IC10 = SN65LVDS1DBVT: High-Speed Differential Line Driver; Manufacturer: TEXAS INSTRUMENTS; PressFit: No; Bonding: No; Part Number: SN65LVDS1DBVT; Component Kind: Standard; Component Type: Standard; Device: SN65LVDS1DBVT; PackageDescription: SOT, 0.95mm pitch; 5 pin, 1.60mm W X 2.90mm L X 1.45mm H body, IPC Medium Density; Part Description: High-Speed Differential Line Driver; Manufacturer Part Number: SN65LVDS1DBVT; Pin Count: 5; Case: SOT23-5; Mounted: Yes; Socket: No; SMD: Yes; Sense: No; ComponentHeight: 1.45mm; Author: CERN DEM JLC; HelpURL: \\cern.ch\dfs\Applications\Altium\Datasheets\SN65LVDS1DBVT.pdf; CreateDate: 22.09.2011; LatestRevisionDate: 22.09.2011
IC19 IC20 = SN74LV595APWT: 8-Bit Shift Register With 3-State Output Register; Manufacturer: TEXAS INSTRUMENTS; PressFit: No; Bonding: No; Part Number: SN74LV595APWT; Component Kind: Standard; Component Type: Standard; Device: SN74LV595APWT; PackageDescription: SOP, 0.65mm pitch; 16 pin, 4.40mm W X 5.00mm L X 1.20mm H body IPC Medium Density; Part Description: 8-Bit Shift Register With 3-State Output Register; Manufacturer Part Number: SN74LV595APWT; Pin Count: 16; Case: TSSOP16; Mounted: Yes; Socket: No; SMD: Yes; Sense: No; ComponentHeight: 1.2mm; Author: CERN DEM JLC; HelpURL: \\cern.ch\dfs\Applications\Altium\Datasheets\SN74LV595APWT.pdf; CreateDate: 10.05.2012; LatestRevisionDate: 10.05.2012
R14-R24 = R0402_100R_1%_0.1W_100PPM: Resistor - 1%; Part Description: General Purpose Thick Film Chip Resistor; Manufacturer: GENERIC; Manufacturer Part Number: R0402_100R_1%_0.1W_100PPM_50V; Manufacturer1 Part Number: ERJ2RKF1000X; Power: 0.1W; TC: ±100ppm/°C; Voltage: 50V; Part Number: R0402_100R_1%_0.1W_100PPM; Component Kind: Standard; Component Type: Standard; Pin Count: 2; Value: 100; Status: Not recommended; Tolerance: ±1%; Case: 0402; Mounted: Yes; Sense: No; Socket: No; SMD: Yes; Manufacturer1 Example: PANASONIC; Manufacturer1 ComponentHeight: 0.4mm; HelpURL: \\cern.ch\dfs\Applications\Altium\Datasheets\R0402_PANASONIC_ERJ2RK.pdf; Author: CERN DEM JLC; CreateDate: 12.12.2013; LatestRevisionDate: 03.03.2015

## Sheet I2C_switch.SchDoc: =DocumentName
size A4; SPICEModelCacheVGBTAUBO: <root> / <DocumentId>VGBTAUBO</DocumentId> / </root>; DocumentNumber: 1; Revision: 0; SheetNumber: 10; SheetTotal: 15; Version: 2.3.1; Author 1: Grzegorz Kasprowicz; Author 2: Łukasz Pająk; Author 3: Krzysztof Belewicz; Github: https://github.com/sinara-hw/Sampler; Last modified by: Maciej Przybysz
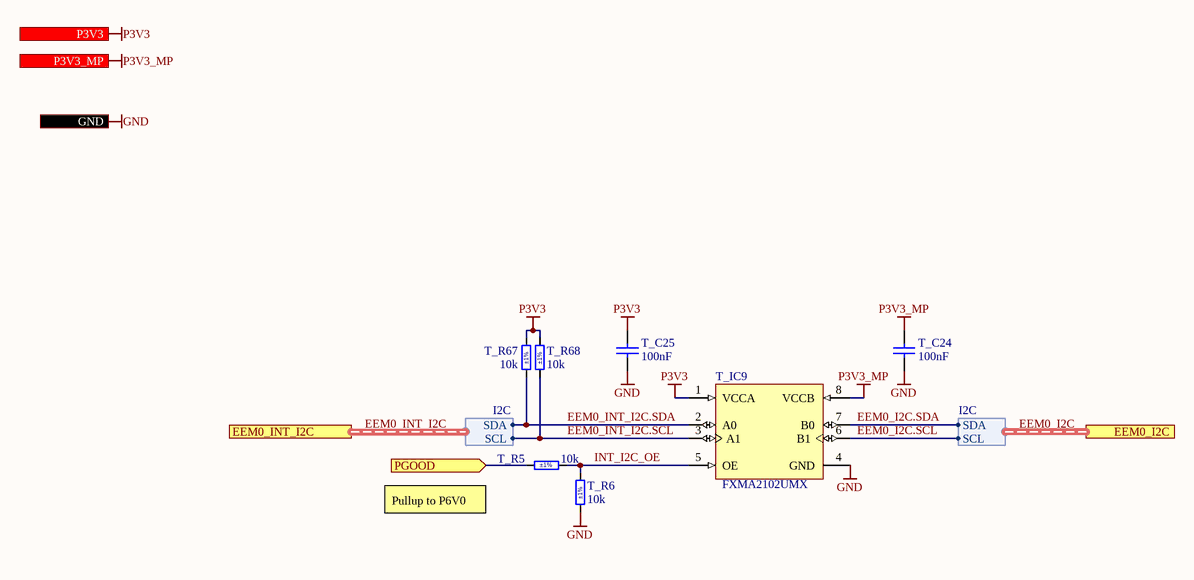
[diagram p13: I2C_switch.SchDoc]

### Parts
T_C24  100nF  [CAPC1005X55N]
T_C25  100nF  [CAPC1005X55N]
T_IC9  FXMA2102UMX  [FXMA2102UMX]
T_R5  10k  Tolerance: ±1%  [RESC1005X40N]
T_R6  10k  Tolerance: ±1%  [RESC1005X40N]
T_R67  10k  Tolerance: ±1%  [RESC1005X40N]
T_R68  10k  Tolerance: ±1%  [RESC1005X40N]

### Ports
EEM0_I2C (harness I2C), EEM0_INT_I2C (harness I2C), GND, P3V3 (in), P3V3_MP (in), PGOOD (in)

### Harnesses
I2C: SDA, SCL

### Nets
GND: T_C24.1 T_C25.1 T_IC9.4(GND) T_R6.1 ; port GND
P3V3: T_C25.2 T_IC9.1(VCCA) T_R67.2 T_R68.2 ; port P3V3
P3V3_MP: T_C24.2 T_IC9.8(VCCB) ; port P3V3_MP
EEM0_I2C.SCL: T_IC9.6(B1) ; port EEM0_I2C.SCL
EEM0_I2C.SDA: T_IC9.7(B0) ; port EEM0_I2C.SDA
EEM0_INT_I2C.SCL: T_IC9.3(A1) T_R68.1 ; port EEM0_INT_I2C.SCL
EEM0_INT_I2C.SDA: T_IC9.2(A0) T_R67.1 ; port EEM0_INT_I2C.SDA
INT_I2C_OE: T_IC9.5(OE) T_R5.2 T_R6.2
PGOOD: T_R5.1 ; port PGOOD

### Buses and harness runs
harness EEM0_I2C = port EEM0_I2C
harness EEM0_INT_I2C = port EEM0_INT_I2C

### Notes on the sheet
- (near T_R5) Pullup to P6V0
- SINARA
- Project:
- Designed by:
- Filename:
- Size:
- Version:
- Last mod. date :
- Sheet:
- A4
- Copyright _______________
  This source describes Open Hardware and is licensed under the CERN-OHL-W v2. You may redistribute and modify this documentation and make products using it under the terms of the CERN-OHL-W v2 (https:/cern.ch/cern-ohl). This documentation is distributed WITHOUT ANY EXPRESS OR IMPLIED WARRANTY, INCLUDING OF MERCHANTABILITY, SATISFACTORY QUALITY AND FITNESS FOR A PARTICULAR PURPOSE. Please see the CERN-OHL-W v2 for applicable conditions.
  As per CERN-OHL-W v2 section 4.1, should You produce hardware based on these sources, You must maintain the Source Location visible on the external case of the product you make using this documentation.
  Source location: =Github
- Last mod. by :

### Library data of the parts
T_C24 T_C25 = CC0402_100NF_50V_10%_X7R: as T_C3-T_C6 on sheet EEM_Connectors; Part Number: CC0402_100NF_50V_10%_X7R; Component Kind: Standard; Component Type: Standard; Pin Count: 2; Value: 100nF; Status: None; Manufacturer Part Number: CC0402_100NF_50V_10%_X7R; Case: 0402; Mounted: Yes; Socket: No; SMD: Yes; Sense: No; Manufacturer1 Example: MURATA; Manufacturer1 ComponentHeight: 0.55mm; HelpURL: \\cern.ch\dfs\Applications\Altium\Datasheets\CC0402_MURATA_GRM155R71H104KE14D.pdf; Author: CERN DEM MR; CreateDate: 30.06.2017; LatestRevisionDate: 30.06.2017
T_IC9 = CMP-015-00014-1: Dual Supply 2-Bit Voltage Translator/Buffer/Repeater Isolator for I2C Applications; Manufacturer: Onsemi; Max Supply Voltage: 5.5V; Min Supply Voltage: 1.65V; Min Operating Temperature: -40°C; Pins: 8; Max Operating Temperature: 85°C; Manufacaturer Part Number: FXMA2102UMX; Mounting Technology: Surface Mount
T_R5 T_R6 T_R67 T_R68 = R0402_10K_1%_0.0625W_100PPM: Resistor - 1%; Part Description: General Purpose Thick Film Chip Resistor; Manufacturer: GENERIC; Manufacturer1 Part Number: 232270671003L; TC: ±100ppm/°C; PressFit: No; Part Number: R0402_10K_1%_0.0625W_100PPM; Component Kind: Standard; Component Type: Standard; Pin Count: 2; Value: 10k; Status: Not Recommended; Power: 0.0625W; Manufacturer Part Number: R0402_10K_1%_0.0625W_100PPM; Case: 0402; Mounted: Yes; Sense: No; Socket: No; SMD: Yes; Manufacturer1 Example: YAGEO PHYCOMP; Manufacturer1 ComponentHeight: 0.4mm; HelpURL: \\cern.ch\dfs\Applications\Altium\Datasheets\R0402_Phycomp_RC0402.pdf; Author: CERN DEM JLC; CreateDate: 03.12.2007; LatestRevisionDate: 17.10.2012

## Sheet PWR_input_connector.SchDoc: =DocumentName
size A4; DocumentNumber: 1; Revision: 0; SheetNumber: 2; SheetTotal: 13; Version: 2.3.1; Author 1: Grzegorz Kasprowicz; Author 2: Łukasz Pająk; Author 3: Krzysztof Belewicz; Github: https://github.com/sinara-hw/Sampler; Last modified by: Maciej Przybysz
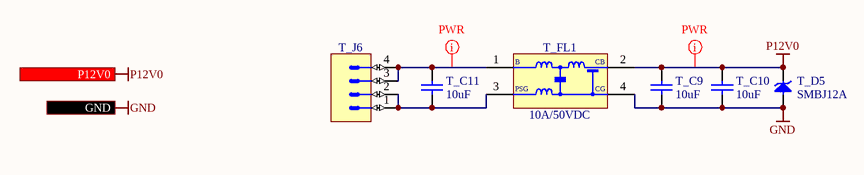
[diagram p14: PWR_input_connector.SchDoc]

### Parts
T_C9  10uF  [CAPC2012X95N]
T_C10  10uF  [CAPC2012X95N]
T_C11  10uF  [CAPC2012X95N]
T_D5  SMBJ12A  [DIOM5336X265N]
T_FL1  10A/50VDC  [FIL_MURATA_BNX02]
T_J6  Mini-Fit Jr.™  [MOLEX_39-30-0040]  (value not drawn)

### Ports
GND, P12V0 (out)

### Nets
GND: T_C9.1 T_C10.1 T_D5.2(A) T_FL1.4(CG) ; port GND
P12V0: T_C9.2 T_C10.2 T_D5.1(C) T_FL1.2(CB) ; port P12V0
NetT_C11_1: T_C11.1 T_FL1.3(PSG) T_J6.1 T_J6.2
NetT_C11_2: T_C11.2 T_FL1.1(B) T_J6.3 T_J6.4

### Layout directives
net class PWR: NetT_C11_2, P12V0

### Notes on the sheet
- SINARA
- Project:
- Designed by:
- Filename:
- Size:
- Version:
- Last mod. date :
- Sheet:
- A4
- Copyright _______________
  This source describes Open Hardware and is licensed under the CERN-OHL-W v2. You may redistribute and modify this documentation and make products using it under the terms of the CERN-OHL-W v2 (https:/cern.ch/cern-ohl). This documentation is distributed WITHOUT ANY EXPRESS OR IMPLIED WARRANTY, INCLUDING OF MERCHANTABILITY, SATISFACTORY QUALITY AND FITNESS FOR A PARTICULAR PURPOSE. Please see the CERN-OHL-W v2 for applicable conditions.
  As per CERN-OHL-W v2 section 4.1, should You produce hardware based on these sources, You must maintain the Source Location visible on the external case of the product you make using this documentation.
  Source location: =Github
- Last mod. by :

### Library data of the parts
T_C9-T_C11 = CC0805_10UF_25V_10%_X5R: Non-polarised capacitor; Part Description: SMD Multilayer Chip Ceramic Capacitor; Manufacturer: GENERIC; Manufacturer1 Part Number: GRM219R61E106KA12D; Voltage: 25V; TC: X5R; Tolerance: ±10%; Part Number: CC0805_10UF_25V_10%_X5R; Component Kind: Standard; Component Type: Standard; Pin Count: 2; Value: 10uF; Status: Preferred; Manufacturer Part Number: CC0805_10UF_25V_10%_X5R; Case: 0805; Mounted: Yes; Socket: No; SMD: Yes; Sense: No; Manufacturer1 Example: MURATA; Manufacturer1 ComponentHeight: 0.95mm; HelpURL: \\cern.ch\dfs\Applications\Altium\Datasheets\CC0805_X5R_MURATA_GRM.pdf; Author: CERN DEM JLC; CreateDate: 25.10.2012; LatestRevisionDate: 06.09.2016
T_D5 = SMBJ12A: Zener Diode; Part Description: Uni-Directional Transient Voltage Suppressor Diode; Manufacturer: FAIRCHILD SEMICONDUCTOR; Voltage: 12V; Power: 600W; PressFit: No; Bonding: No; Part Number: SMBJ12A; Component Kind: Standard; Component Type: Standard; Device: SMBJ12A; PackageDescription: DO-214-AA/SMB Diode, Molded Body; 5.34mm L X 3.625mm W X 2.65mm H, IPC Medium Density; Manufacturer Part Number: SMBJ12A; Pin Count: 2; Case: DO-214AA; Mounted: Yes; Socket: No; SMD: Yes; Sense: No; ComponentHeight: 2.65mm; HelpURL: \\cern.ch\dfs\Applications\Altium\Datasheets\SMBJ.pdf; Author: CERN DEM JLC; CreateDate: 10.04.2013; LatestRevisionDate: 10.04.2013
T_FL1 = FIL_MURATA_BNX022-01L: Block Type EMIFIL (LC Combined); Part Description: Block Type EMIFIL (LC Combined) SMD Type, BNX02* Series; Manufacturer: MURATA; Resistance: 0.5R; Part Number: FIL_MURATA_BNX022-01L; Component Kind: Standard; Component Type: Standard; Pin Count: 2; Value: 10A/50VDC; Status: None; Manufacturer Part Number: BNX022-01L; Mounted: Yes; Socket: No; SMD: Yes; Sense: No; ComponentHeight: 3.3mm; HelpURL: \\cern.ch\dfs\Applications\Altium\Datasheets\FIL_MURATA_BNX022-01L.pdf; Author: CERN DEM JLC; CreateDate: 10.10.2012; LatestRevisionDate: 10.10.2012
T_J6 = MOLEX_39-30-0040: Connector 4 Male; Part Description: 4.20mm (.165") Pitch Mini-Fit Jr. Header, Dual Row, Right Angle with Snap-in Plastic Peg PCB Lock, 4 Circuits; Manufacturer: MOLEX; PressFit: No; Part Number: MOLEX_39-30-0040; Component Kind: Standard; Component Type: Standard; Pin Count: 4; Family: Mini-Fit Jr.™; Mounted: Yes; Socket: No; SMD: No; Sense: No; Status: None; Manufacturer Part Number: 39-30-0040; ComponentHeight: 11.4mm; HelpURL: \\cern.ch\dfs\Applications\Altium\Datasheets\MOLEX_39-30-0040.pdf; Author: CERN DEM JLC; CreateDate: 2018-10-02; LatestRevisionDate: 2018-10-02